# Altium schematic sheet Sheet1.SchDoc
size A4; SheetNumber: 1; SheetTotal: 5
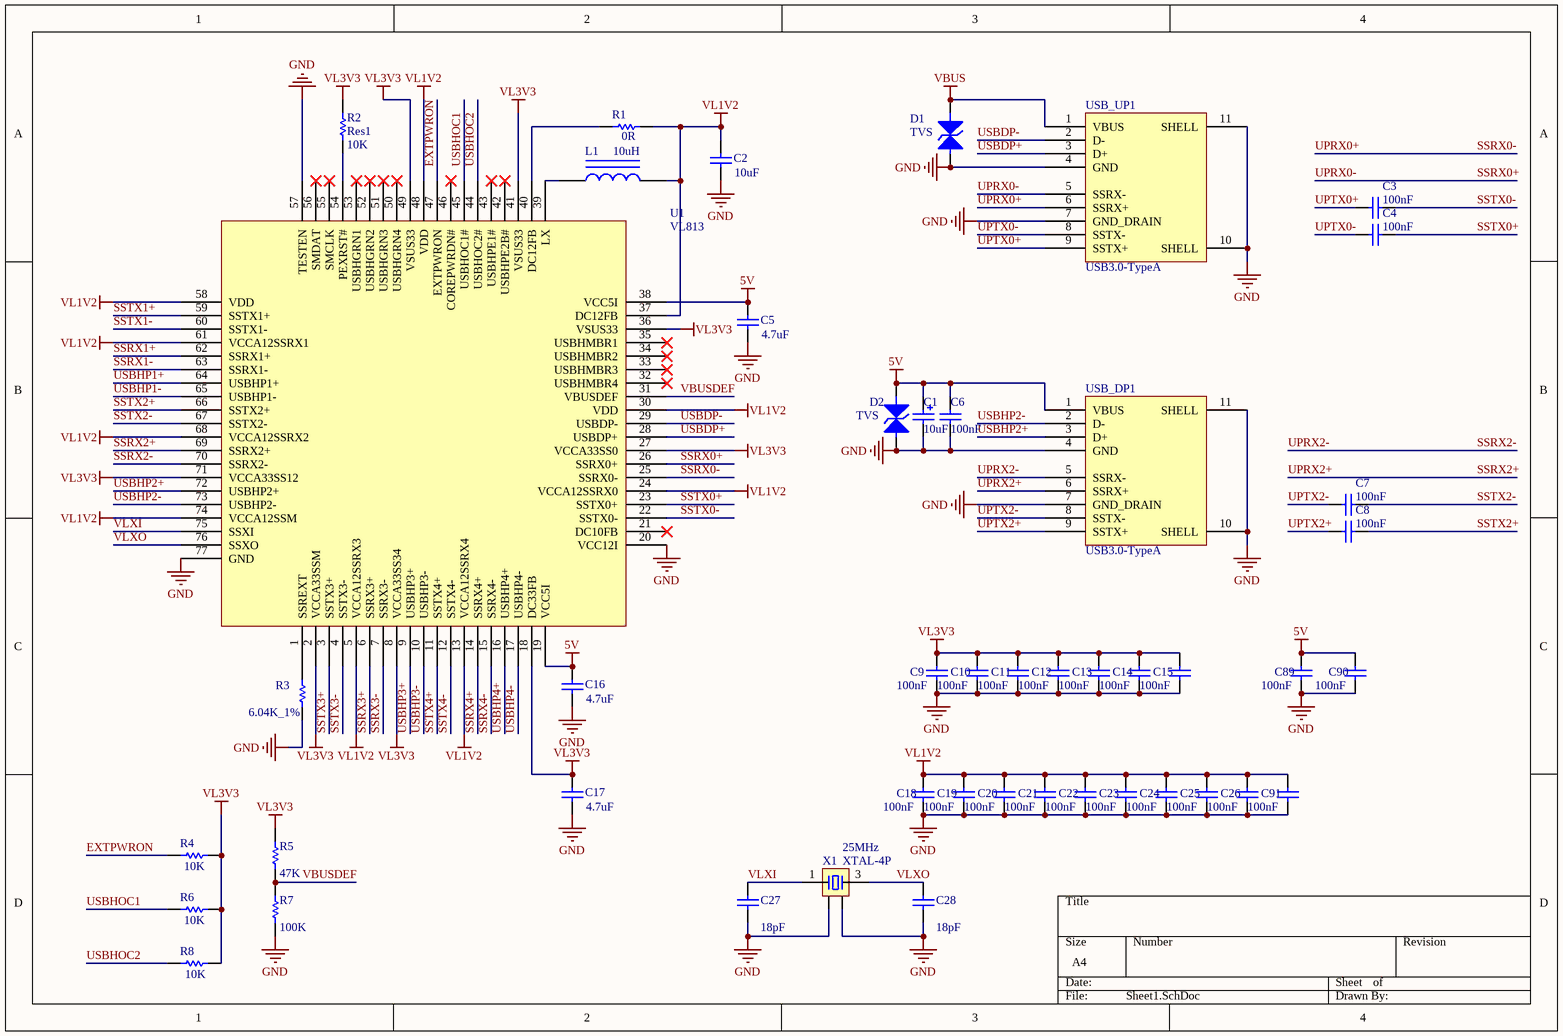
[diagram p0: Sheet1.SchDoc]

## Parts
C1  value 10uF  [TAJ-A/3216]  (hidden comment: Cap Pol2)
C2  value 10uF  [C0603_M]  (hidden comment: Cap)
C3  value 100nF  [C0402_M]  (hidden comment: Cap)
C4  value 100nF  [C0402_M]  (hidden comment: Cap)
C5  value 4.7uF  [C0603_M]  (hidden comment: Cap)
C6  value 100nF  [C0603_M]  (hidden comment: Cap)
C7  value 100nF  [C0402_M]  (hidden comment: Cap)
C8  value 100nF  [C0402_M]  (hidden comment: Cap)
C9  value 100nF  [C0603_M]  (hidden comment: Cap)
C10  value 100nF  [C0603_M]  (hidden comment: Cap)
C11  value 100nF  [C0603_M]  (hidden comment: Cap)
C12  value 100nF  [C0603_M]  (hidden comment: Cap)
C13  value 100nF  [C0603_M]  (hidden comment: Cap)
C14  value 100nF  [C0603_M]  (hidden comment: Cap)
C15  value 100nF  [C0603_M]  (hidden comment: Cap)
C16  value 4.7uF  [C0603_M]  (hidden comment: Cap)
C17  value 4.7uF  [C0603_M]  (hidden comment: Cap)
C18  value 100nF  [C0603_M]  (hidden comment: Cap)
C19  value 100nF  [C0603_M]  (hidden comment: Cap)
C20  value 100nF  [C0603_M]  (hidden comment: Cap)
C21  value 100nF  [C0603_M]  (hidden comment: Cap)
C22  value 100nF  [C0603_M]  (hidden comment: Cap)
C23  value 100nF  [C0603_M]  (hidden comment: Cap)
C24  value 100nF  [C0603_M]  (hidden comment: Cap)
C25  value 100nF  [C0603_M]  (hidden comment: Cap)
C26  value 100nF  [C0603_M]  (hidden comment: Cap)
C27  value 18pF  [C0603_M]  (hidden comment: Cap)
C28  value 18pF  [C0603_M]  (hidden comment: Cap)
C89  value 100nF  [C0603_M]  (hidden comment: Cap)
C90  value 100nF  [C0603_M]  (hidden comment: Cap)
C91  value 100nF  [C0603_M]  (hidden comment: Cap)
D1  TVS  [SOD-123]
D2  TVS  [SOD-123]
L1  value 10uH  [SWPA3012]  (hidden comment: Inductor Iron)
R1  value 0R  [R0603_M]  (hidden comment: Res1)
R2  Res1  value 10K  [R0603_M]
R3  value 6.04K_1%  [R0603_M]  (hidden comment: Res1)
R4  value 10K  [R0603_M]  (hidden comment: Res1)
R5  value 47K  [R0603_M]  (hidden comment: Res1)
R6  value 10K  [R0603_M]  (hidden comment: Res1)
R7  value 100K  [R0603_M]  (hidden comment: Res1)
R8  value 10K  [R0603_M]  (hidden comment: Res1)
U1  VL813  [QFN-76_L9.0-W9.0]
USB_DP1  USB3.0-TypeA  [USB3.1 Type-A_DIP_F]
USB_UP1  USB3.0-TypeA  [USB3.1 Type-A_DIP_F]
X1  XTAL-4P  Parameter 1: 25MHz  [OSC 3225-4P]

## Nets
5V: C1.1 C5.2 C6.1 C16.2 C89.1 C90.1 D2.K U1.19(VCC5I) U1.38(VCC5I) USB_DP1.1(VBUS)
GND: C1.2 C2.1 C5.1 C6.2 C9.2 C10.2 C11.2 C12.2 C13.2 C14.2 C15.2 C16.1 C17.1 C18.2 C19.2 C20.2 C21.2 C22.2 C23.2 C24.2 C25.2 C26.2 C27.2 C28.2 C89.2 C90.2 C91.2 D1.A D2.A R3.1 R7.1 U1.20(VCC12I) U1.57(TESTEN) U1.77(GND) USB_DP1.4(GND) USB_DP1.7(GND_DRAIN) USB_DP1.10(SHELL) USB_DP1.11(SHELL) USB_UP1.4(GND) USB_UP1.7(GND_DRAIN) USB_UP1.10(SHELL) USB_UP1.11(SHELL) X1.2 X1.4
VBUS: D1.K USB_UP1.1(VBUS)
VL1V2: C2.2 C18.1 C19.1 C20.1 C21.1 C22.1 C23.1 C24.1 C25.1 C26.1 C91.1 L1.2 R1.2 U1.5(VCCA12SSRX3) U1.13(VCCA12SSRX4) U1.24(VCCA12SSRX0) U1.30(VDD) U1.37(DC12FB) U1.48(VDD) U1.58(VDD) U1.61(VCCA12SSRX1) U1.68(VCCA12SSRX2) U1.74(VCCA12SSM)
VL3V3: C9.1 C10.1 C11.1 C12.1 C13.1 C14.1 C15.1 C17.2 R2.2 R4.1 R5.2 R6.1 R8.1 U1.2(VCCA33SSM) U1.8(VCCA33SS34) U1.18(DC33FB) U1.27(VCCA33SS0) U1.36(VSUS33) U1.41(VSUS33) U1.49(VSUS33) U1.71(VCCA33SS12)
EXTPWRON: R4.2 U1.47(EXTPWRON)
SSRX0+: U1.26(SSRX0+) USB_UP1.5(SSRX-)  [also labelled UPRX0-]
SSRX0-: U1.25(SSRX0-) USB_UP1.6(SSRX+)  [also labelled UPRX0+]
SSRX1+: U1.62(SSRX1+)
SSRX1-: U1.63(SSRX1-)
SSRX2+: U1.69(SSRX2+) USB_DP1.6(SSRX+)  [also labelled UPRX2+]
SSRX2-: U1.70(SSRX2-) USB_DP1.5(SSRX-)  [also labelled UPRX2-]
SSRX3+: U1.6(SSRX3+)
SSRX3-: U1.7(SSRX3-)
SSRX4+: U1.14(SSRX4+)
SSRX4-: U1.15(SSRX4-)
SSTX0+: C4.1 U1.23(SSTX0+)
SSTX0-: C3.1 U1.22(SSTX0-)
SSTX1+: U1.59(SSTX1+)
SSTX1-: U1.60(SSTX1-)
SSTX2+: C8.1 U1.66(SSTX2+)
SSTX2-: C7.1 U1.67(SSTX2-)
SSTX3+: U1.3(SSTX3+)
SSTX3-: U1.4(SSTX3-)
SSTX4+: U1.11(SSTX4+)
SSTX4-: U1.12(SSTX4-)
UPTX0+: C3.2 USB_UP1.9(SSTX+)
UPTX0-: C4.2 USB_UP1.8(SSTX-)
UPTX2+: C8.2 USB_DP1.9(SSTX+)
UPTX2-: C7.2 USB_DP1.8(SSTX-)
USBDP+: U1.28(USBDP+) USB_UP1.3(D+)
USBDP-: U1.29(USBDP-) USB_UP1.2(D-)
USBHOC1: R6.2 U1.45(USBHOC1#)
USBHOC2: R8.2 U1.44(USBHOC2#)
USBHP1+: U1.64(USBHP1+)
USBHP1-: U1.65(USBHP1-)
USBHP2+: U1.72(USBHP2+) USB_DP1.3(D+)
USBHP2-: U1.73(USBHP2-) USB_DP1.2(D-)
USBHP3+: U1.9(USBHP3+)
USBHP3-: U1.10(USBHP3-)
USBHP4+: U1.16(USBHP4+)
USBHP4-: U1.17(USBHP4-)
VBUSDEF: R5.1 R7.2 U1.31(VBUSDEF)
VLXI: C27.1 U1.75(SSXI) X1.1
VLXO: C28.1 U1.76(SSXO) X1.3
NetL1_1: L1.1 U1.39(LX)
NetR1_1: R1.1 U1.40(DC12FB)
NetR2_1: R2.1 U1.54(PEXRST#)
NetR3_2: R3.2 U1.1(SSREXT)

Not connected (* = marked no-connect by the designer): U1 21(DC10FB)* 32(USBHMBR4)* 33(USBHMBR3)* 34(USBHMBR2)* 35(USBHMBR1)* 42(USBHPE2B#)* 43(USBHPE1#)* 46(COREPWRDN#)* 50(USBHGRN4)* 51(USBHGRN3)* 52(USBHGRN2)* 53(USBHGRN1)* 55(SMCLK)* 56(SMDAT)*

## Library data of the parts
C1 = Cap Pol2: Polarized Capacitor (Axial); Published: 8-Jun-2000; LatestRevisionDate: 17-Jul-2002; LatestRevisionNote: Re-released for DXP Platform.; PackageReference: POLAR0.8; Publisher: Altium Limited; PackageDescription: Polarized Capacitor; 2 Leads
C2-C28 C89-C91 = Cap: Capacitor; Published: 8-Jun-2000; LatestRevisionDate: 17-Jul-2002; LatestRevisionNote: Re-released for DXP Platform.; PackageReference: RAD-0.3; Publisher: Altium Limited; PackageDescription: Radial Cap, Thru-Hole; 2 Leads; 0.3 in Pin Spacing
D1 D2 = TVS: 双向瞬态抑制二极管
L1 = Inductor Iron: Magnetic-Core Inductor; Published: 24-Mar-1999; LatestRevisionDate: 17-Jul-2002; LatestRevisionNote: Re-released for DXP Platform.; PackageReference: AXIAL-0.9; Publisher: Altium Limited; PackageDescription: Axial Device, Thru-Hole; 2 Leads; 0.9 in Pin Spacing
R1-R8 = Res1: Resistor; Published: 8-Jun-2000; LatestRevisionDate: 17-Jul-2002; LatestRevisionNote: Re-released for DXP Platform.; PackageReference: AXIAL-0.3; Publisher: Altium Limited; PackageDescription: Axial Device, Thru-Hole; 2 Leads; 0.3 in Pin Spacing
U1 = VL813: USB3.0 Hub
X1 = XTAL-4P: 4脚无源晶振